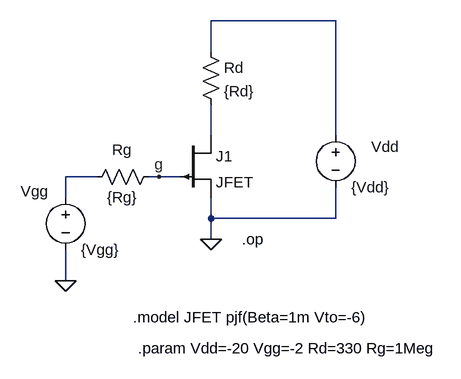
[diagram p0: schematic FET01op.asc]
FET01op.asc, the LTspice schematic file:
Version 4
SHEET 1 1608 1076
WIRE 384 -128 192 -128
WIRE 192 -80 192 -128
WIRE 192 48 192 0
WIRE 384 48 384 -128
WIRE 16 112 -32 112
WIRE 112 112 96 112
WIRE 144 112 112 112
WIRE -32 144 -32 112
WIRE 192 176 192 144
WIRE 384 176 384 128
WIRE 384 176 192 176
WIRE 192 208 192 176
WIRE -32 272 -32 224
FLAG 192 208 0
FLAG -32 272 0
FLAG 112 112 g
SYMBOL res 112 96 R90
WINDOW 0 -10 57 VBottom 2
WINDOW 3 32 56 VTop 2
SYMATTR InstName Rg
SYMATTR Value {Rg}
SYMBOL voltage 384 32 R0
WINDOW 0 55 34 Left 2
WINDOW 123 0 0 Left 0
WINDOW 39 0 0 Left 0
SYMATTR InstName Vdd
SYMATTR Value {Vdd}
SYMBOL voltage -32 128 R0
WINDOW 0 -69 6 Left 2
SYMATTR InstName Vgg
SYMATTR Value {Vgg}
SYMBOL res 176 -96 R0
SYMATTR InstName Rd
SYMATTR Value {Rd}
SYMBOL pjf 144 48 R0
SYMATTR InstName J1
SYMATTR Value JFET
TEXT 240 208 Left 2 !.op
TEXT 72 328 Left 2 !.model JFET pjf(Beta=1m Vto=-6)
TEXT 80 376 Left 2 !.param Vdd=-20 Vgg=-2 Rd=330 Rg=1Meg

The netlist it stands for:
* FET01op.asc
Rg g N003 {Rg}
Vdd N001 0 {Vdd}
Vgg N003 0 {Vgg}
Rd N001 N002 {Rd}
J1 N002 g 0 JFET
.model NJF NJF
.model PJF PJF
.lib standard.jft
.op
.model JFET pjf(Beta=1m Vto=-6)
.param Vdd=-20 Vgg=-2 Rd=330 Rg=1Meg
.backanno
.end